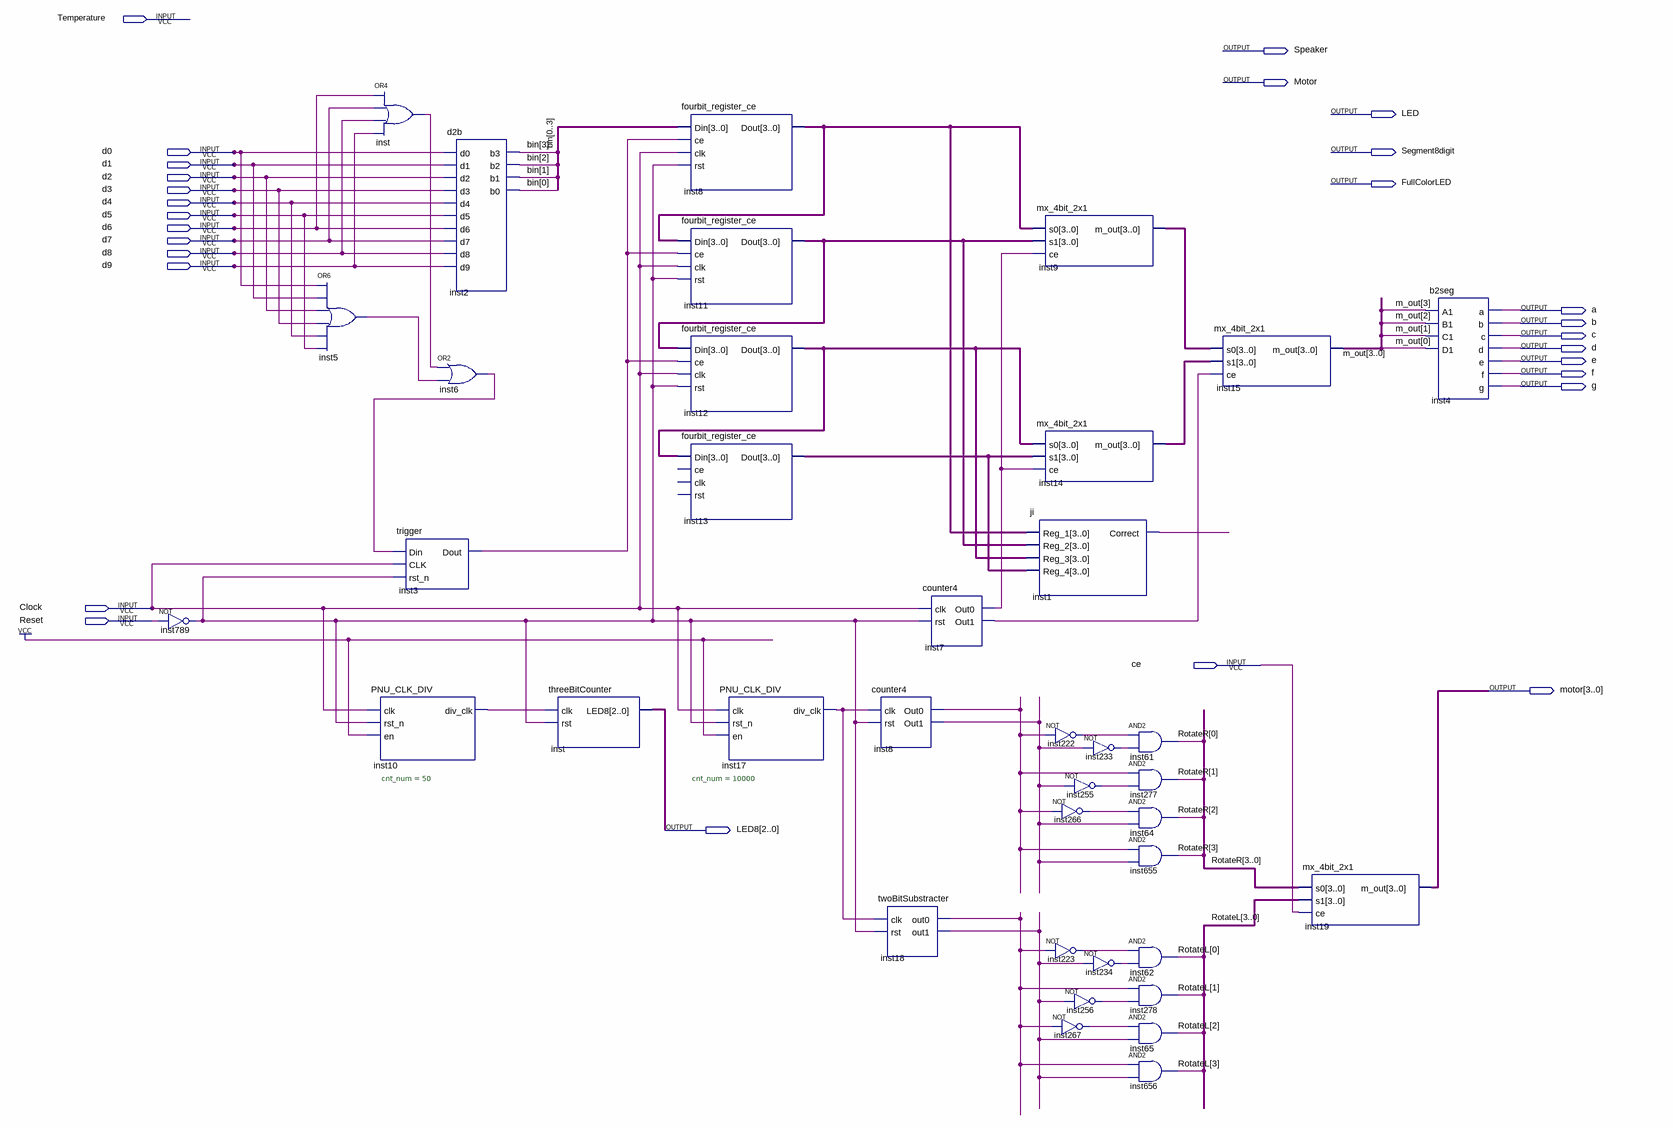
[diagram p0: schematic sheet]
// Quartus schematic Project.bdf as structural Verilog: 38 symbols, 28 pins
module Project (
  input  Temperature,
  input  d0,
  input  d1,
  input  d2,
  input  d3,
  input  d4,
  input  d5,
  input  d6,
  input  d7,
  input  d8,
  input  d9,
  input  Clock,
  input  Reset,
  input  ce,
  output Speaker,
  output Motor_1bit,
  output LED,
  output Segment8digit,
  output FullColorLED,
  output a,
  output b,
  output c,
  output d,
  output e,
  output f,
  output g,
  output [3:0] Motor,
  output [2:0] LED8
);

  wire inst1_correct, inst3_dout, inst5_out, inst6_out, inst7_out0, inst7_out1, inst8_out0, inst8_out1,
       inst10_div_clk, inst17_div_clk, inst18_out0, inst18_out1, inst222_out, inst223_out, inst233_out,
       inst234_out, inst255_out, inst256_out, inst266_out, inst267_out, inst789_out, inst_out;
  wire [3:0] bin, inst8_dout, inst9_m_out, inst11_dout, inst12_dout, inst13_dout, inst14_m_out, m_out,
       RotateL, RotateR;

  not inst789 (inst789_out, Reset);
  or inst5 (inst5_out, d0, d1, d2, d3, d4, d5);
  or inst (inst_out, d6, d7, d8, d9);
  trigger inst3 (.Din(inst6_out), .CLK(Clock), .rst_n(inst789_out), .Dout(inst3_dout));
  PNU_CLK_DIV #(.cnt_num(50)) inst10 (.clk(Clock), .rst_n(inst789_out), .en(1'b1), .div_clk(inst10_div_clk));
  d2b inst2 (
    .d0(d0), .d1(d1), .d2(d2), .d3(d3), .d4(d4), .d5(d5), .d6(d6), .d7(d7), .d8(d8), .d9(d9), .b3(bin[3]),
    .b2(bin[2]), .b1(bin[1]), .b0(bin[0]));
  or inst6 (inst6_out, inst_out, inst5_out);
  threeBitCounter inst_dup2 (.clk(inst10_div_clk), .rst(inst789_out), .LED8(LED8));
  fourbit_register_ce inst8 (
    .Din({bin[0], bin[1], bin[2], bin[3]}), .ce(inst3_dout), .clk(Clock), .rst(inst789_out), .Dout(inst8_dout));
  fourbit_register_ce inst11 (.Din(inst8_dout), .ce(inst3_dout), .clk(Clock), .rst(inst789_out), .Dout(inst11_dout));
  fourbit_register_ce inst12 (.Din(inst11_dout), .ce(inst3_dout), .clk(Clock), .rst(inst789_out), .Dout(inst12_dout));
  fourbit_register_ce inst13 (.Din(inst12_dout), .Dout(inst13_dout));  // open: ce, clk, rst
  PNU_CLK_DIV #(.cnt_num(10000)) inst17 (.clk(Clock), .rst_n(inst789_out), .en(1'b1), .div_clk(inst17_div_clk));
  counter4 inst8_dup2 (.clk(inst17_div_clk), .rst(inst789_out), .Out0(inst8_out0), .Out1(inst8_out1));
  twoBitSubstracter inst18 (.clk(inst17_div_clk), .rst(inst789_out), .out0(inst18_out0), .out1(inst18_out1));
  counter4 inst7 (.clk(Clock), .rst(inst789_out), .Out0(inst7_out0), .Out1(inst7_out1));
  mx_4bit_2x1 inst9 (.s0(inst8_dout), .s1(inst11_dout), .ce(inst7_out0), .m_out(inst9_m_out));
  mx_4bit_2x1 inst14 (.s0(inst12_dout), .s1(inst13_dout), .ce(inst7_out0), .m_out(inst14_m_out));
  ji inst1 (.Reg_1(inst8_dout), .Reg_2(inst11_dout), .Reg_3(inst12_dout), .Reg_4(inst13_dout), .Correct(inst1_correct));
  not inst222 (inst222_out, inst8_out0);
  not inst255 (inst255_out, inst8_out1);
  not inst266 (inst266_out, inst8_out0);
  not inst223 (inst223_out, inst18_out0);
  not inst256 (inst256_out, inst18_out1);
  not inst267 (inst267_out, inst18_out0);
  not inst233 (inst233_out, inst8_out1);
  not inst234 (inst234_out, inst18_out1);
  and inst61 (RotateR[0], inst222_out, inst233_out);
  and inst277 (RotateR[1], inst8_out0, inst255_out);
  and inst64 (RotateR[2], inst266_out, inst8_out1);
  and inst655 (RotateR[3], inst8_out0, inst8_out1);
  and inst62 (RotateL[0], inst223_out, inst234_out);
  and inst278 (RotateL[1], inst18_out0, inst256_out);
  and inst65 (RotateL[2], inst267_out, inst18_out1);
  and inst656 (RotateL[3], inst18_out0, inst18_out1);
  mx_4bit_2x1 inst15 (.s0(inst9_m_out), .s1(inst14_m_out), .ce(inst7_out1), .m_out(m_out));
  mx_4bit_2x1 inst19 (.s0(RotateR), .s1(RotateL), .ce(ce), .m_out(Motor));
  b2seg inst4 (
    .A1(m_out[3]), .B1(m_out[2]), .C1(m_out[1]), .D1(m_out[0]), .a(a), .b(b), .c(c), .d(d), .e(e), .f(f),
    .g(g));
endmodule
